# EAGLE schematic talkbit (EAGLE 9.0.0)
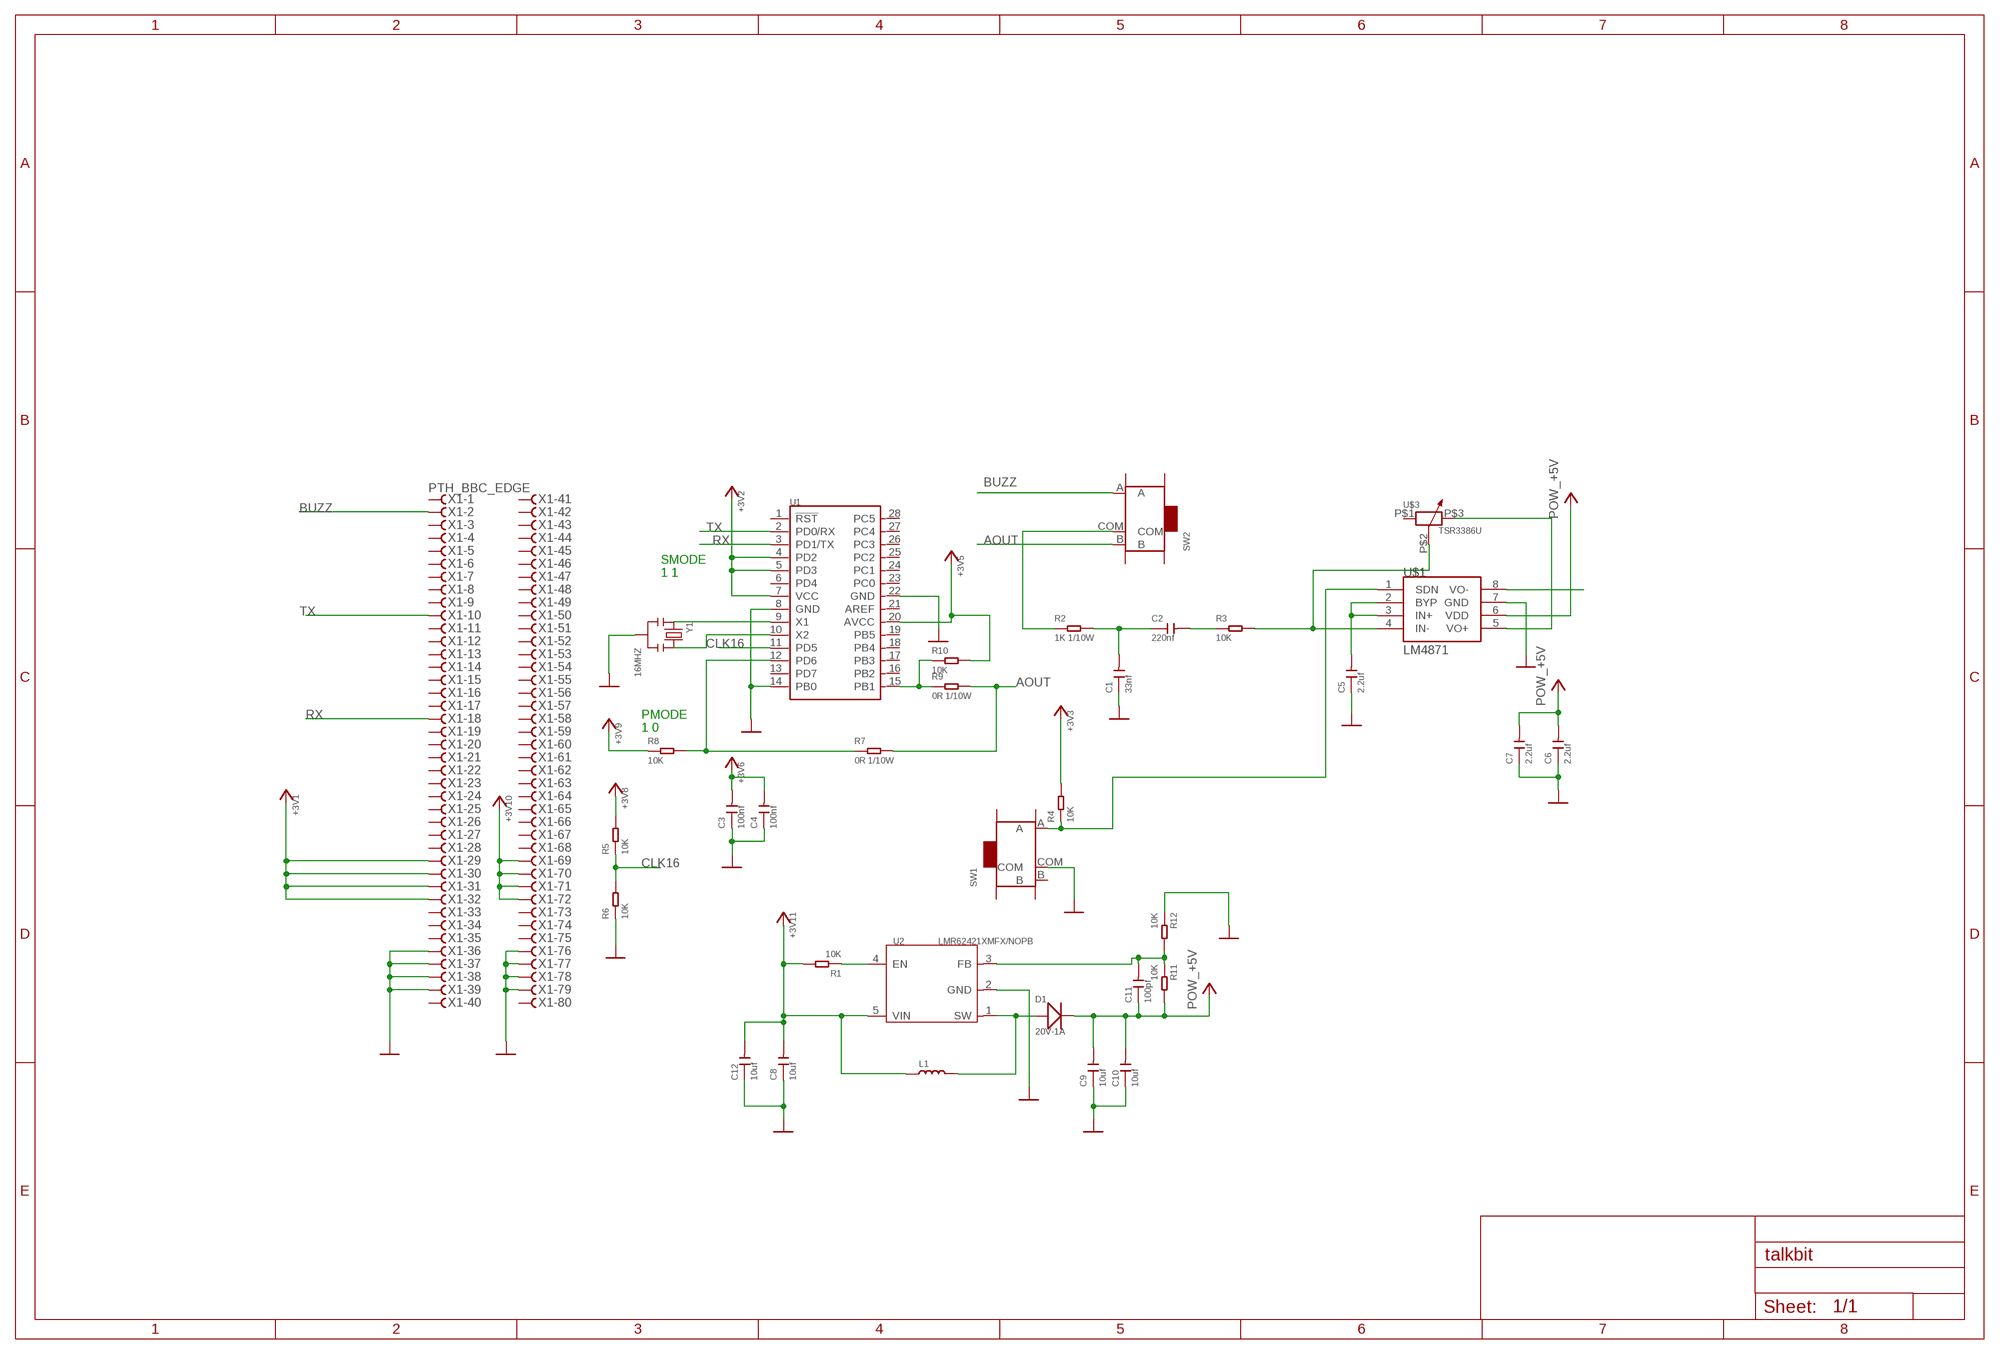
[diagram p0: schematic, sheet 1]

## Parts
C1  33nf  CERAMIC-33NF-50V-10%-X7R(0603)  [C0603]
C2  220nf  CERAMIC-220NF-25V-10%-X7R(0603)  [C0603]
C3  100nf  CERAMIC-100NF-50V-10%-X7R(0603)  [C0603]
C4  100nf  CERAMIC-100NF-50V-10%-X7R(0603)  [C0603]
C5  2.2uf  CERAMIC-2.2UF-10V-10%-X7R(0603)  [C0603]
C6  2.2uf  CERAMIC-2.2UF-10V-10%-X7R(0603)  [C0603]
C7  2.2uf  CERAMIC-2.2UF-10V-10%-X7R(0603)  [C0603]
C8  10uf  CERAMIC-10UF-10V-10%-X5R(0603)  [C0603]
C9  10uf  CERAMIC-10UF-10V-10%-X5R(0603)  [C0603]
C10  10uf  CERAMIC-10UF-10V-10%-X5R(0603)  [C0603]
C11  100pf  CERAMIC-100PF-50V-5%-NPO(0603)  [C0603]
C12  10uf  CERAMIC-10UF-10V-10%-X5R(0603)  [C0603]
D1  20V-1A  SMD-DIODE-SCHOTTKY-20V-1A(SOD-123)  [SOD-123]
L1  SMD-INDUCTOR-10UH-20%-2.35A(2P-5X5X4MM)  [L5040S]
R1  10K  SMD-RES-10K-1%-1/10W(0603)  [R0603]
R2  1K 1/10W  SMD-RES-1K-5%-1/10W(0603)  [R0603]
R3  10K  SMD-RES-10K-1%-1/10W(0603)  [R0603]
R4  10K  SMD-RES-10K-1%-1/10W(0603)  [R0603]
R5  10K  SMD-RES-10K-1%-1/10W(0603)  [R0603]
R6  10K  SMD-RES-10K-1%-1/10W(0603)  [R0603]
R7  0R 1/10W  SMD-RES-0R-1%-1/10W(0603)  [R0603]
R8  10K  SMD-RES-10K-1%-1/10W(0603)  [R0603]
R9  0R 1/10W  SMD-RES-0R-1%-1/10W(0603)  [R0603]
R10  10K  SMD-RES-10K-1%-1/10W(0603)  [R0603]
R11  10K  SMD-RES-10K-1%-1/10W(0603)  [R0603]
R12  10K  SMD-RES-10K-1%-1/10W(0603)  [R0603]
SW1  SMD-TOGGLE-SWITCH-ON-ON(3+4P-6.7X2.7MM)  [SW7-SMD-L6.7X2.7X3.2MM]
SW2  SMD-TOGGLE-SWITCH-ON-ON(3+4P-6.7X2.7MM)  [SW7-SMD-L6.7X2.7X3.2MM]
U1  MCU-ATMEGA328P-PU(DIP28)  [DIP28-2.54-35.6X13.5MM]
U2  LMR62421XMFX/NOPB  PMIC-LMR10510YMFE/NOPB(SOT23-5)  [SOT-23-5]
U$1  LM4871  TPA701  [SOIC8]
U$3  TSR3386U  [DIP3]
X1  PTH_BBC_EDGE  [PTH_BBC_EDGE]
Y1  16MHZ  SMD-RESONATOR-16MHZ-15PF-0.5%-40R(3P-3.2X1.3MM)  [X3-SMD-3.6X1.3X0.8MM]

## Nets
+3V3: C3.2 C4.2 C8.2 C12.2 L1.1 R1.2 R4.2 R5.2 R8.1 R10.2 U1.4(PD2) U1.5(PD3) U1.7(VCC) U1.20(AVCC) U2.5(VIN) X1.29 X1.30 X1.31 X1.32 X1.69 X1.70 X1.71 X1.72 ; supply symbol labelled POW_+3V3
+5V: C6.2 C7.2 C9.2 C10.2 C11.1 D1.- R11.2 U$1.6(VDD) ; supply symbol labelled POW_+5V
AOUT: R7.2 R9.2 SW2.B
BUZZ: SW2.A X1.2
CLK16: R5.1 R6.2 U1.11(PD5)
GND: C1.1 C3.1 C4.1 C5.1 C6.1 C7.1 C8.1 C9.1 C10.1 C12.1 R6.1 R12.1 SW1.COM U1.8(GND) U1.14(PB0) U1.22(GND) U2.2(GND) U$1.7(GND) X1.36 X1.37 X1.38 X1.39 X1.76 X1.77 X1.78 X1.79 Y1.2 ; supply symbol labelled POW_GND
N$1: U$1.8(VO-)
N$2: C1.2 C2.1 R2.2
N$3: C2.2 R3.1
N$4: R3.2 U$1.4(IN-) U$3.P$2
N$5: R7.1 R8.2 U1.12(PD6)
N$6: C5.2 U$1.2(BYP) U$1.3(IN+)
N$7: U$1.5(VO+) U$3.P$3
N$8: R4.1 SW1.A U$1.1(SDN)
N$9: R2.1 SW2.COM
N$10: U1.9(X1) Y1.1
N$11: U1.10(X2) Y1.3
N$12: R9.1 R10.1 U1.15(PB1)
N$13: R1.1 U2.4(EN)
N$14: C11.2 R11.1 R12.2 U2.3(FB)
N$15: D1.+ L1.2 U2.1(SW)
RX: U1.3(PD1/TX) X1.18
TX: U1.2(PD0/RX) X1.10
Unconnected: SW1.B SW1.SS1 SW1.SS2 SW1.SS3 SW1.SS4 SW2.SS1 SW2.SS2 SW2.SS3 SW2.SS4 U1.1(!RST) U1.6(PD4) U1.13(PD7) U1.16(PB2) U1.17(PB3) U1.18(PB4) U1.19(PB5) U1.21(AREF) U1.23(PC0) U1.24(PC1) U1.25(PC2) U1.26(PC3) U1.27(PC4) U1.28(PC5) U$3.P$1 X1.1 X1.3 X1.4 X1.5 X1.6 X1.7 X1.8 X1.9 X1.11 X1.12 X1.13 X1.14 X1.15 X1.16 X1.17 X1.19 X1.20 X1.21 X1.22 X1.23 X1.24 X1.25 X1.26 X1.27 X1.28 X1.33 X1.34 X1.35 X1.40 X1.41 X1.42 X1.43 X1.44 X1.45 X1.46 X1.47 X1.48 X1.49 X1.50 X1.51 X1.52 X1.53 X1.54 X1.55 X1.56 X1.57 X1.58 X1.59 X1.60 X1.61 X1.62 X1.63 X1.64 X1.65 X1.66 X1.67 X1.68 X1.73 X1.74 X1.75 X1.80

## Notes on the sheet
- SMODE
- 1 1
- PMODE
- 1 0

## Library data of the parts
C1 = Seeed-OPL-Capacitor:CERAMIC-33NF-50V-10%-X7R(0603): 302010088; MPN: CC0603KRX7R9BB333
C2 = Seeed-OPL-Capacitor:CERAMIC-220NF-25V-10%-X7R(0603): 302010073; MPN: CC0603KRX7R8BB224
C3 C4 = Seeed-OPL-Capacitor:CERAMIC-100NF-50V-10%-X7R(0603): 302010138; MPN: CC0603KRX7R9BB104
C5-C7 = Seeed-OPL-Capacitor:CERAMIC-2.2UF-10V-10%-X7R(0603): 302010054; MPN: CC0603KRX7R6BB225
C8-C10 C12 = Seeed-Capacitor:CERAMIC-10UF-10V-10%-X5R(0603): 302010103; MPN: CC0603KRX5R6BB106
C11 = Seeed-Capacitor:CERAMIC-100PF-50V-5%-NPO(0603): 302010076; MPN: CC0603JRNPO9BN101
D1 = Seeed-Diode:SMD-DIODE-SCHOTTKY-20V-1A(SOD-123): 304020034; MPN: B5819W
L1 = Seeed-Inductor:SMD-INDUCTOR-10UH-20%-2.35A(2P-5X5X4MM): 303010147
R1 R3-R6 R8 R10-R12 = Seeed-OPL-Resistor:SMD-RES-10K-1%-1/10W(0603): 301010299; MPN: RC0603FR-0710KL
R2 = Seeed-OPL-Resistor:SMD-RES-1K-5%-1/10W(0603): 301010291; MPN: RC0603JR-071KL
R7 R9 = Seeed-OPL-Resistor:SMD-RES-0R-1%-1/10W(0603): 301010203; MPN: AC0603FR-070RL
SW1 SW2 = Seeed-OPL-Switch:SMD-TOGGLE-SWITCH-ON-ON(3+4P-6.7X2.7MM): 311030001
U1 = Seeed-OPL-ic:MCU-ATMEGA328P-PU(DIP28): 310010051; MPN: ATMEGA328P-PU; VALUE-DIP28: ATMEGA328P-PU
U2 = Seeed-OPL-ic:PMIC-LMR10510YMFE/NOPB(SOT23-5): 310030256; MPN: LMR10510YMFE/NOPB; VALUE: LMR10510YMFE/NOPB-SOT23-5
U$1 = akita:TPA701
U$3 = Seeed-OPL-Resistor:TSR3386U
X1 = microbit:PTH_BBC_EDGE: TE CONNECTIVITY / AMP - BUCHSE, SCSI, VERTIKAL, 80 Source: Data sheet <http://www.tycoelectronics.com/commerce/DocumentDelivery/DDEController?Action=srchrtrv&DocNm=5749069&DocType=Customer+Drawing&DocLang=English>
Y1 = Seeed-OPL-Crystal-Oscillator:SMD-RESONATOR-16MHZ-15PF-0.5%-40R(3P-3.2X1.3MM): 306030002; MPN: CSTCE16M0V53-R0